# Altium schematic sheet Top.SchDoc: Top
size 296 x 210 mm; DocumentNumber: 1; SheetNumber: 1; SheetTotal: 4
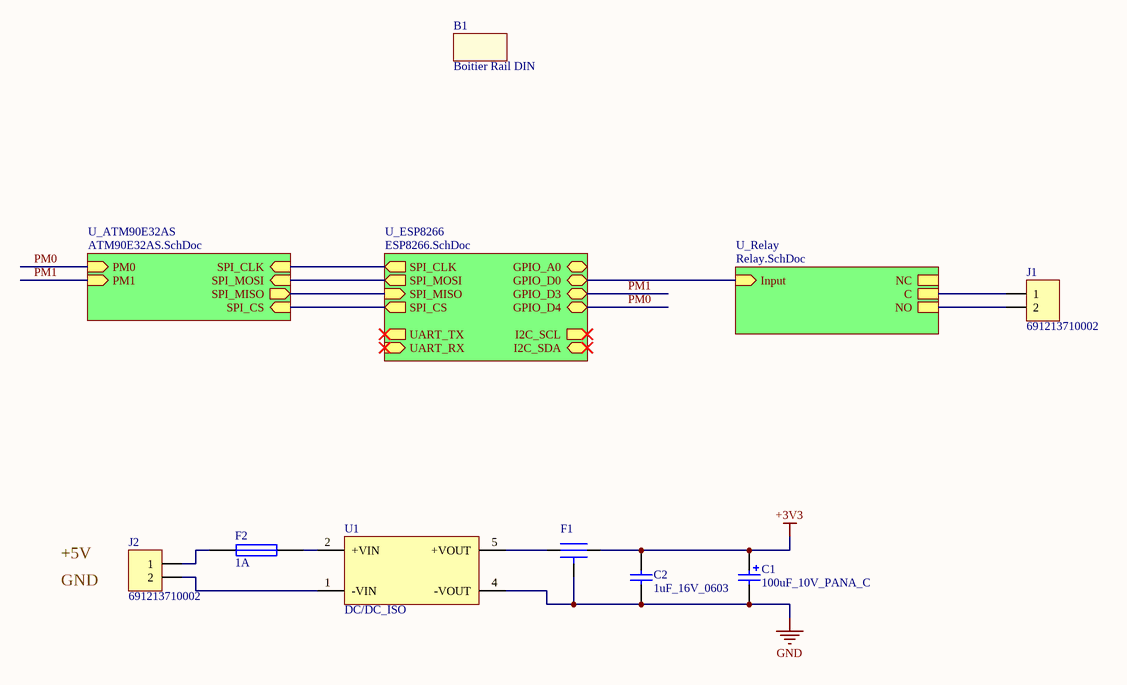
[diagram p0: Top.SchDoc]

## Parts
B1  Boitier Rail DIN
C1  100uF_10V_PANA_C  [CAP_PANA_C]
C2  1uF_16V_0603  [C0603]
F1  EMI  [EMIFIL_0603]  (value not drawn)
F2  1A  [R0603]
J1  691213710002  [691213710002]
J2  691213710002  [691213710002]
U1  DC/DC_ISO  [R1SE]

## Sub-sheets
U_ATM90E32AS = ATM90E32AS.SchDoc: SPI_CLK (in), SPI_MOSI (in), SPI_MISO (out), SPI_CS (in), PM0 (in), PM1 (in)
U_ESP8266 = ESP8266.SchDoc: SPI_CLK (out), SPI_MOSI (out), SPI_MISO (in), SPI_CS (out), UART_RX (in), UART_TX (out), I2C_SDA (bidir), GPIO_D3 (bidir), GPIO_D4 (bidir), I2C_SCL (out), GPIO_D0 (bidir), GPIO_A0 (bidir)
U_Relay = Relay.SchDoc: Input (in), NO, NC, C

## Nets
+3V3: C1.1 C2.2 F1.1
GND: C1.2 C2.1 F1.GND U1.4(-VOUT)
PM0: sheet U_ATM90E32AS/PM0, sheet U_ESP8266/GPIO_D4
PM1: sheet U_ATM90E32AS/PM1, sheet U_ESP8266/GPIO_D3
NetF1_2: F1.2 U1.5(+VOUT)
NetF2_1: F2.1 U1.2(+VIN)
NetF2_2: F2.2 J2.1
NetJ1_1: J1.1 ; sheet U_Relay/C
NetJ1_2: J1.2 ; sheet U_Relay/NO
NetJ2_2: J2.2 U1.1(-VIN)
(unnamed): sheet U_Relay/Input, sheet U_ESP8266/GPIO_D0
(unnamed): sheet U_ATM90E32AS/SPI_CLK, sheet U_ESP8266/SPI_CLK
(unnamed): sheet U_ATM90E32AS/SPI_MOSI, sheet U_ESP8266/SPI_MOSI
(unnamed): sheet U_ATM90E32AS/SPI_MISO, sheet U_ESP8266/SPI_MISO
(unnamed): sheet U_ATM90E32AS/SPI_CS, sheet U_ESP8266/SPI_CS

Not connected (* = marked no-connect by the designer): U1 3(NC) 6(NC) 7(NC) 8(NC)

## Notes on the sheet
- +5V
- GND
- Verified By :
- Approved By :
- Size:
- Sheet:
- Name:
- A4
- /
- Revision:
- Date:
- Engineer:
- Time:

## Library data of the parts
B1 = Component: Part of schematic; MPN: DMB4771; MF: BUD INDUSTRIES; Supplier 1: Farnell; Supplier Part Number 1: 2473160; Supplier Pricing 1: 3,62 €
C1 = Cap Pol: Polarized Capacitor (Radial); MPN: EEE1AA101WR; MF: PANASONIC ELECTRONIC COMPONENTS; Supplier 1: Farnell; Supplier Part Number 1: 2807991; Supplier Pricing 1: 0,274 €
C2 = Cap: Capacitor; MPN: 885012106017; MF: WURTH ELEKTRONIK; Supplier 1: Farnell; Supplier Part Number 1: 2533943; Supplier Pricing 1: 0,0886€
F1 = EMIFIL_0603: FILTER CAP 0.1UF 2A 16V 0603; MPN: NFM18PC104R1C3D; MF: MURATA; Supplier 1: Farnell; Supplier Part Number 1: 1686508; Supplier Pricing 1: 0,083 €
F2 = Fuse 1: Fuse; MPN: MCCFB0603TFF/1; MF: MULTICOMP; Supplier Pricing 1: 0,101 €; Supplier Part Number 1: 2849996; Supplier 1: Farnell
J1 J2 = 691213710002: WR-TBL Horizontal Entry Modular with Rising Cage Clamp,Serie 213 - 5.00 mm; MF: Wurth Elektronik; ComponentLink1 Description: Manufacturer; ComponentLink2 Description: Datasheet; Supplier Part Number 1: 2493614; MPN: 691213710002; ComponentLink1URL: http://www.we-online.com; ComponentLink2URL: http://katalog.we-online.de/em/datasheet/6912137100xx.pdf; Supplier Pricing 1: 0,308 €; Supplier 1: Farnell
U1 = DC/DC_ISO: CONVERTER DC/DC ISOLATED; MPN: ISH0503A; MF: XP POWER; Supplier Pricing 1: 6,95 €; Supplier 1: Farnell; Supplier Part Number 1: 2484118